# Altium schematic sheet Connectors.SchDoc
size A; SheetNumber: 3; SheetTotal: 3
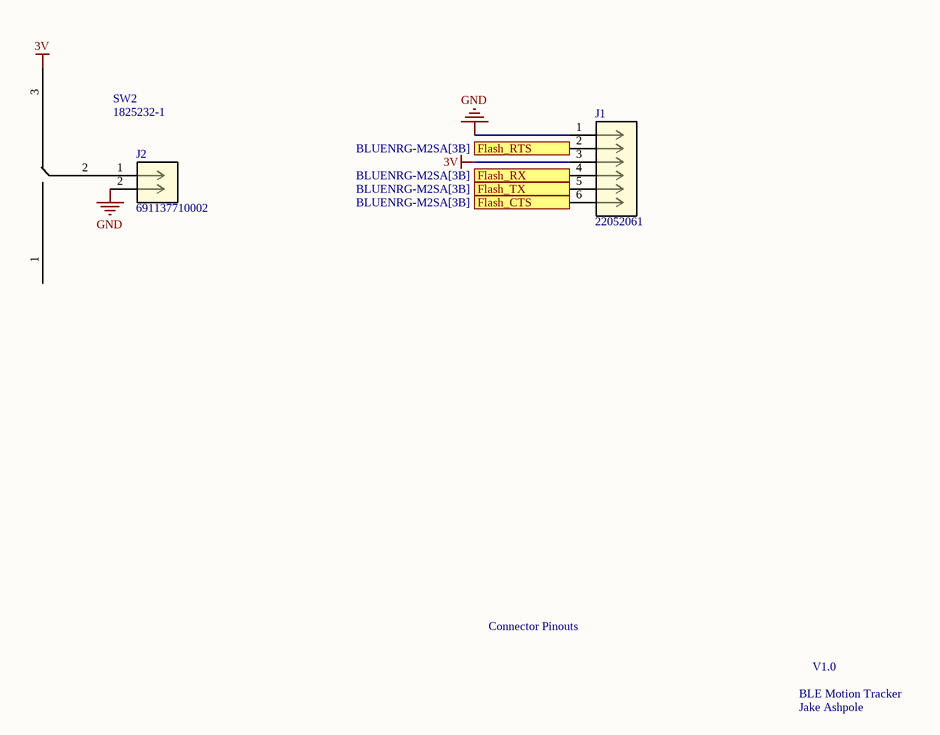
[diagram p0: Connectors.SchDoc]

## Parts
J1  22052061  [CONN_22-05-2061_MOL]
J2  691137710002  [CONN2_710002_WRE]
SW2  1825232-1  [1825232-1_TEC]

## Ports
Flash_CTS (out, see BLUENRG-M2SA[3B]), Flash_RTS (in, see BLUENRG-M2SA[3B]), Flash_RX (out, see BLUENRG-M2SA[3B]), Flash_TX (in, see BLUENRG-M2SA[3B])

## Nets
3V: J1.3 SW2.3
GND: J1.1 J2.2
Flash_CTS: J1.6 ; port Flash_CTS
Flash_RTS: J1.2 ; port Flash_RTS
Flash_RX: J1.4 ; port Flash_RX
Flash_TX: J1.5 ; port Flash_TX
NetJ2_1: J2.1 SW2.2

Not connected (* = marked no-connect by the designer): SW2 1

## Notes on the sheet
- Connector Pinouts
- BLE Motion Tracker
- V1.0
- Jake Ashpole

## Library data of the parts
J1 = 22052061: FTDI UART Flashing connector -- https://www.mouser.com/ProductDetail/Molex/22-05-2061?qs=th8CuLdcYnn%252BP%252BN0RJkmpg%3D%3D; Mfr_Name: Molex Connector Corporation; RefDes: RefDes; Type: Type
J2 = 691137710002: Connector to provide Battery voltage -- https://www.mouser.com/ProductDetail/Wurth-Elektronik/691137910002?qs=sPbYRqrBIVkdp9j8kfiV1w%3D%3D; Mfr_Name: Wurth Electronics; RefDes: RefDes; Type: Type
SW2 = 1825232-1: https://www.mouser.com/ProductDetail/655-1825232-1; Mfr_Name: TE Connectivity; RefDes: RefDes; Type: Type